# EAGLE design adaptor (EAGLE 8.4.1)
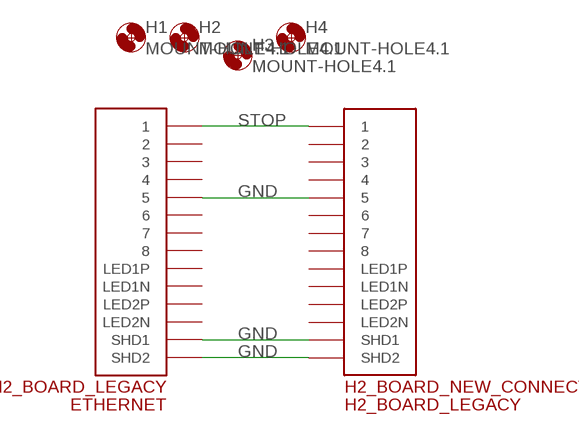
[diagram p0: schematic, sheet 1]

## Parts
H1  MOUNT-HOLE4.1  [4,1]
H2  MOUNT-HOLE4.1  [4,1]
H2_BOARD_LEGACY  ETHERNET  [A122645-ND]
H2_BOARD_NEW_CONNECTOR  H2_BOARD_LEGACY  ETHERNET  [A122645-ND]
H3  MOUNT-HOLE4.1  [4,1]
H4  MOUNT-HOLE4.1  [4,1]

## Nets
GND: H2_BOARD_LEGACY.P$5 H2_BOARD_LEGACY.P$13(SHD1) H2_BOARD_LEGACY.P$14(SHD2) H2_BOARD_NEW_CONNECTOR.P$5 H2_BOARD_NEW_CONNECTOR.P$13(SHD1) H2_BOARD_NEW_CONNECTOR.P$14(SHD2)
STOP: H2_BOARD_LEGACY.P$1 H2_BOARD_NEW_CONNECTOR.P$1
Unconnected: H2_BOARD_LEGACY.P$2 H2_BOARD_LEGACY.P$3 H2_BOARD_LEGACY.P$4 H2_BOARD_LEGACY.P$6 H2_BOARD_LEGACY.P$7 H2_BOARD_LEGACY.P$8 H2_BOARD_LEGACY.P$9(LED1N) H2_BOARD_LEGACY.P$10(LED1P) H2_BOARD_LEGACY.P$11(LED2N) H2_BOARD_LEGACY.P$12(LED2P) H2_BOARD_NEW_CONNECTOR.P$2 H2_BOARD_NEW_CONNECTOR.P$3 H2_BOARD_NEW_CONNECTOR.P$4 H2_BOARD_NEW_CONNECTOR.P$6 H2_BOARD_NEW_CONNECTOR.P$7 H2_BOARD_NEW_CONNECTOR.P$8 H2_BOARD_NEW_CONNECTOR.P$9(LED1N) H2_BOARD_NEW_CONNECTOR.P$10(LED1P) H2_BOARD_NEW_CONNECTOR.P$11(LED2N) H2_BOARD_NEW_CONNECTOR.P$12(LED2P)

## Library data of the parts
H1-H4 = holes:MOUNT-HOLE: MOUNTING HOLE with drill center marker
H2_BOARD_LEGACY H2_BOARD_NEW_CONNECTOR = FCC_parts:ETHERNET: Ethernet port with 2 leds. digikey number A122645-ND

## Board
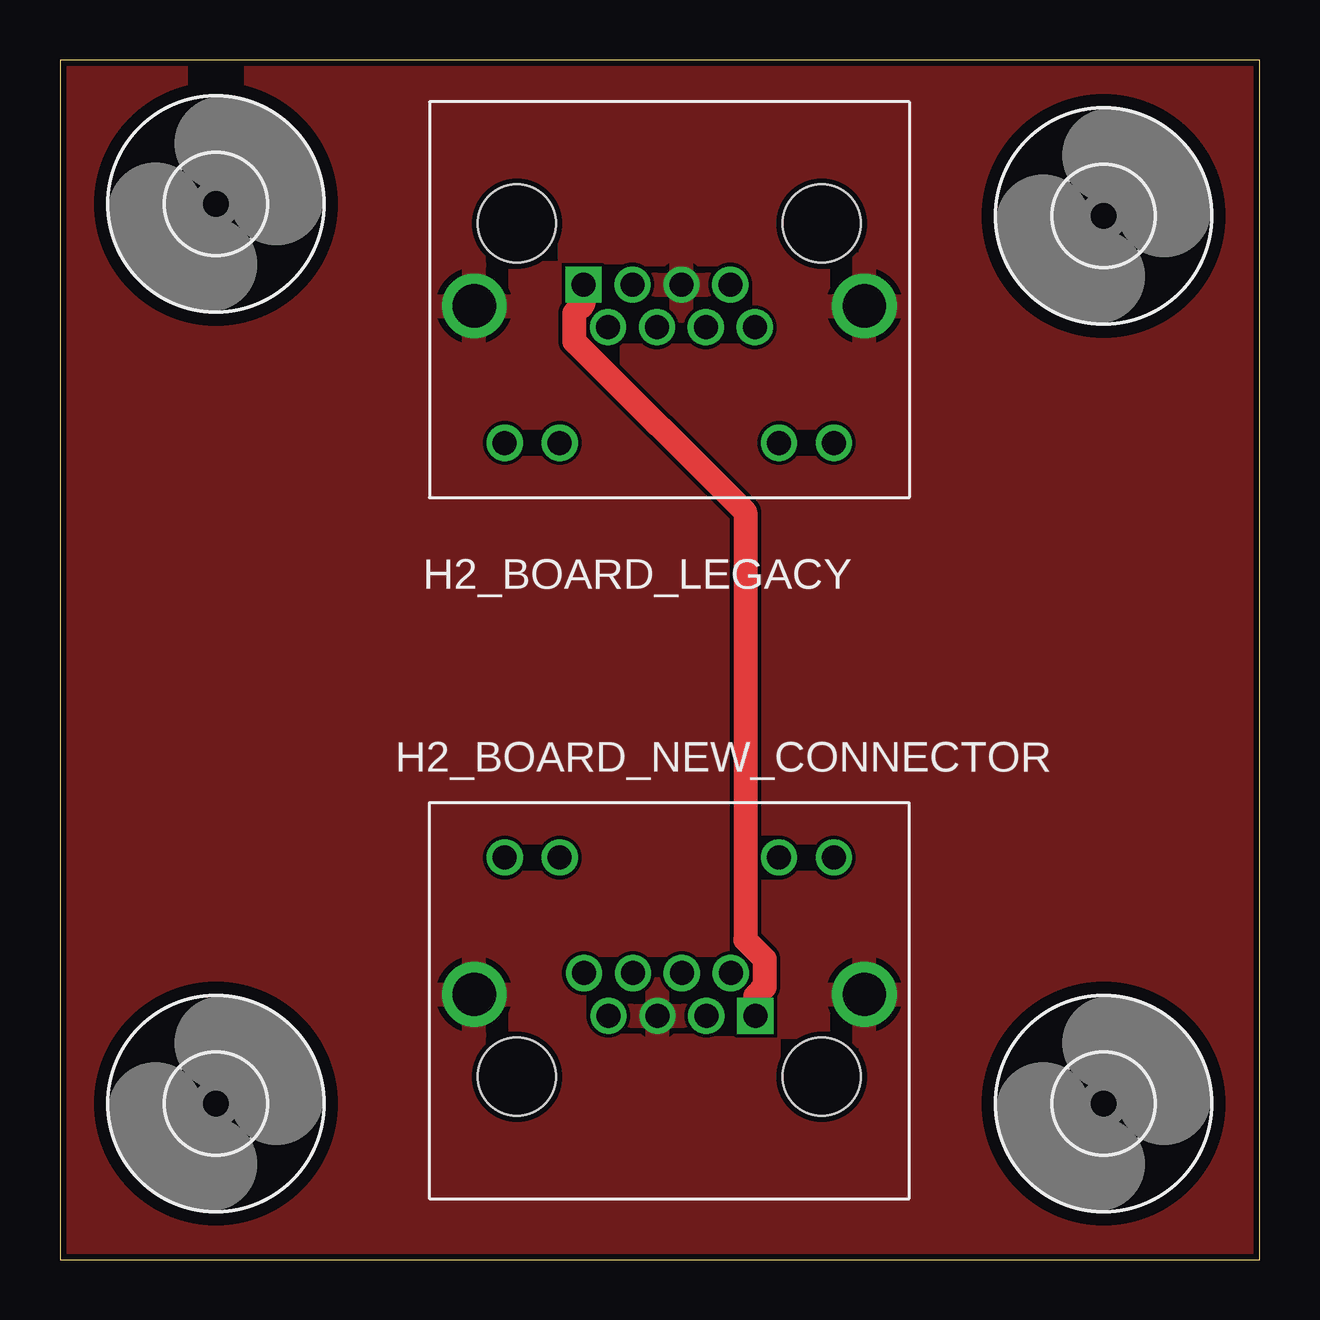
[diagram p1: board, top side]

Size 50 x 50 mm. Coordinates in mm from the lower left corner, seen from the top.
Outline: 0,0 50,0 50,50 0,50 0,0
Copper layers (1*16): Top 0.035mm / dielectric 1.5mm / Bottom 0.035mm
Design rules "SeeedStudio_2layer_DRU_no_angle_20140221": minimum track width 6mil, minimum drill 12mil, track to track 6mil, track to pad 6mil, pad to pad 6mil, via to via 6mil, smd to smd 0mil, copper to edge 10mil, drill to drill 10mil, minimum pad ring 10mil, minimum via ring 6mil, stop-mask expansion 2mil, vias tented up to drill 100mil, thermal gap 10mil

### Footprints (pad centres in the part's own frame; a part is rotated, then mirrored left to right if it is on the bottom)
4,1 = hole 4.1: 0,0
A122645-ND = drill 1 square: P$1 3.58,2.54 | drill 1: P$2 2.56,4.32; P$3 1.54,2.54; P$4 0.52,4.32; P$5 -0.5,2.54; P$6 -1.52,4.32; P$7 -2.54,2.54; P$8 -3.56,4.32; P$9 -6.86,9.14; P$10 -4.57,9.14; P$11 4.57,9.14; P$12 6.86,9.14 | drill 1.8: P$13 -8.13,3.43; P$14 8.13,3.43 | hole 3.25: -6.35,0; 6.35,0

### Placement (x,y rotation side)
H1  6.5,44 0 top
H2  6.5,6.5 0 top
H2_BOARD_LEGACY  25.4,43.18 180 top
H2_BOARD_NEW_CONNECTOR  25.4,7.62 0 top
H3  43.5,6.5 0 top
H4  43.5,43.5 0 top

### Tracks (layer width: path | path; a pad name or v marks a point on that pad's centre or on a via)
GND
  pour Top: -2.54,53.34 52.07,53.34 52.07,-3.81 -3.81,-3.81 -2.54,-2.54
STOP
  Top 1: H2_BOARD_NEW_CONNECTOR.P$1 28.98,10.97 29.37,11.36 29.37,12.52 28.56,13.32 28.56,31.15 21.43,38.28 21.43,39.44 21.82,39.83 H2_BOARD_LEGACY.P$1